# EasyEDA Pro project MicroMouse_v03_full_plane.eprj, board PCB2
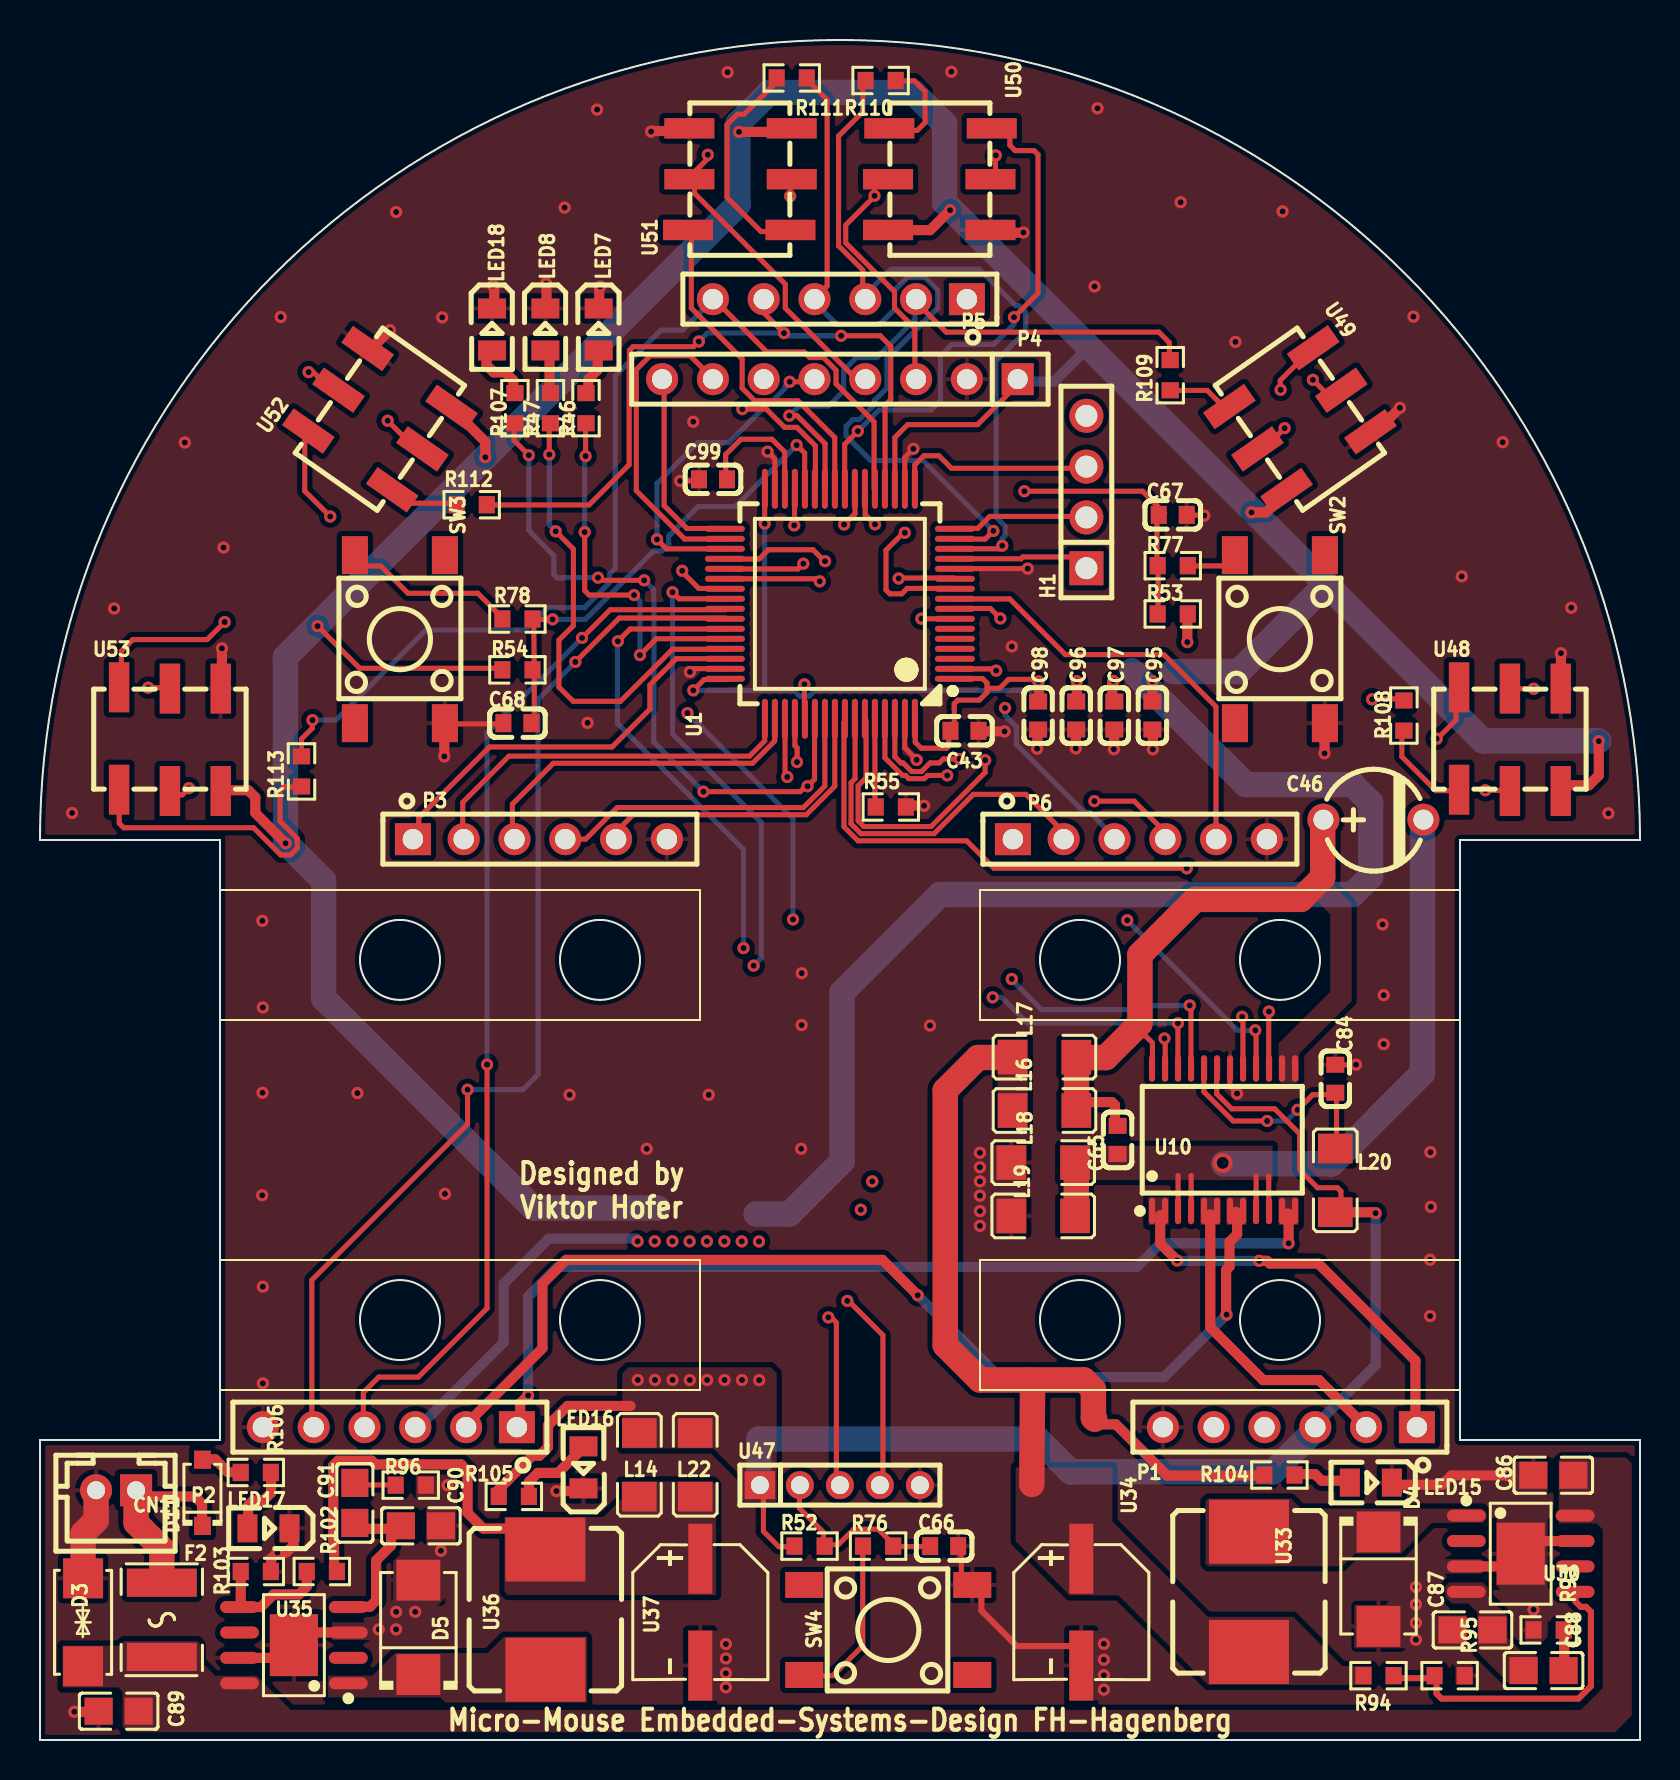
[diagram p4: board, top side]
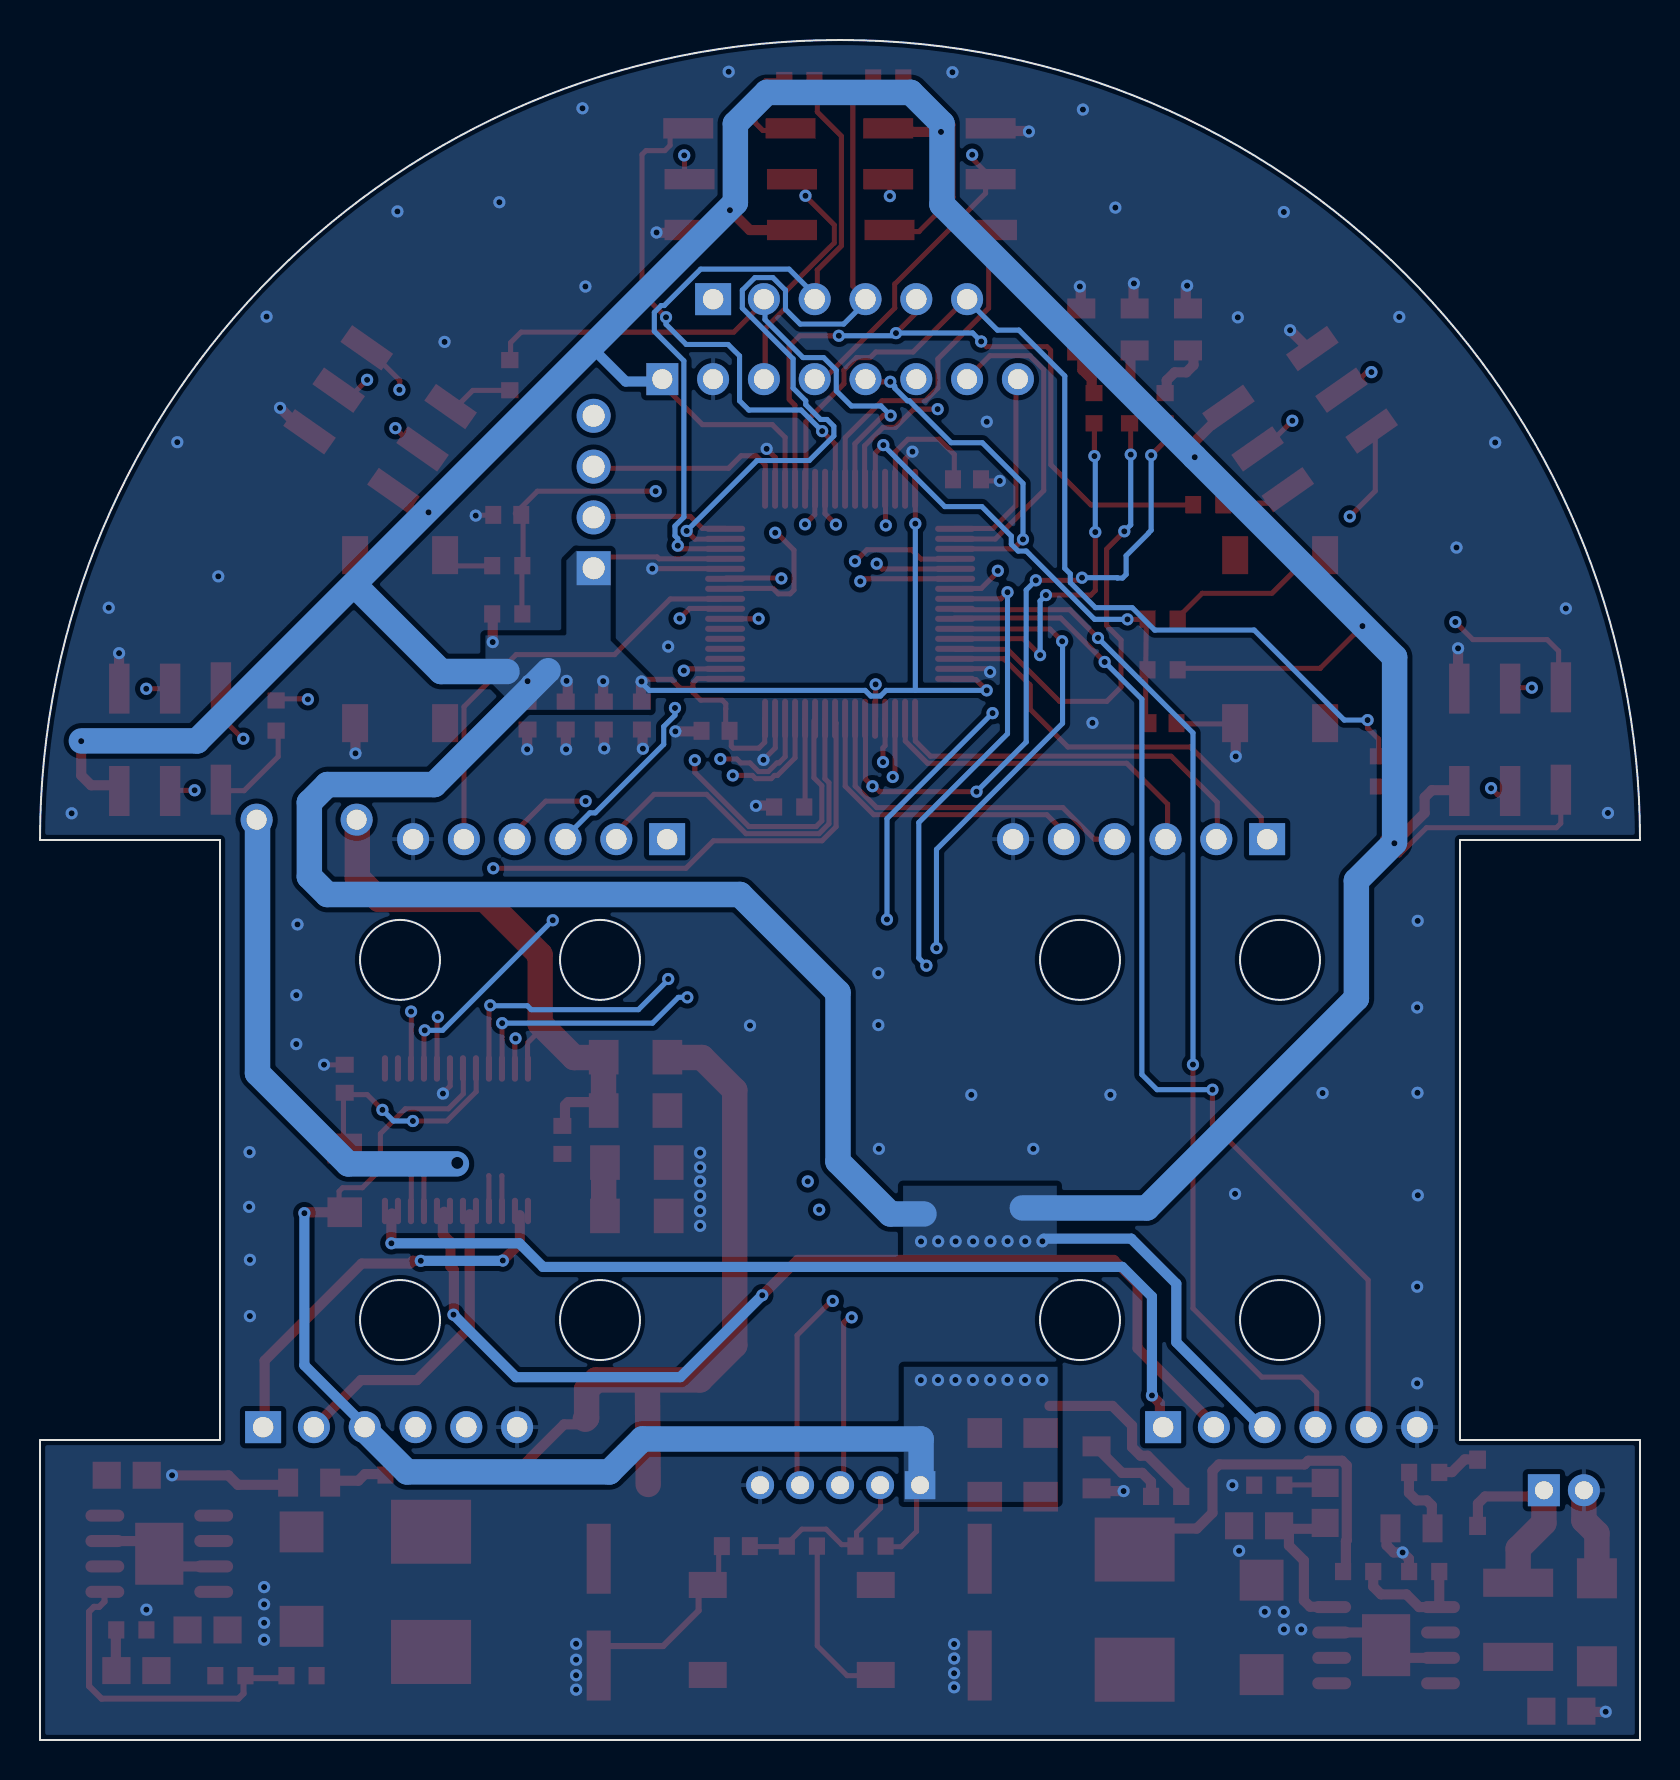
[diagram p5: board, bottom side, seen from below]

Outline 80 x 85 mm; copper layers: Top Layer, Inner1, Inner2, Inner3, Inner4, Bottom Layer. Coordinates in mm from the lower left corner of the outline.
Outline path: circle c18,39.01 r2 ; circle c18,21 r2 ; circle c28,39.01 r2 ; circle c28,21 r2 ; circle c52,39.01 r2 ; circle c52,21 r2 ; circle c62,39.01 r2 ; circle c62,21 r2 ; 9,42.5 9,30 ; 9,36 9,21 ; 71,42.5 71,23.75 71,36 ; 0,45 arc(40,85) 80,45 71,45 71,15 80,15 80,0 0,0 0,15 9,15 9,45 0,45
Stack: Top Layer 0.035mm Outer layer thickness 1oz / Dielectric1 0.0994mm 3313 RC57% 4.2mil / Inner1 0.0152mm Inner layer thickness / Dielectric2 0.55mm 0.55mm H/H No copper / Inner2 0.0152mm Inner layer thickness / Dielectric3 0.1088mm 2116 RC54% 4.9mil / Inner3 0.0152mm Inner layer thickness / Dielectric4 0.55mm 0.55mm H/H No copper / Inner4 0.0152mm Inner layer thickness / Dielectric5 0.0994mm 3313 RC57% 4.2mil / Bottom Layer 0.035mm Outer layer thickness 1oz

## Design rules (mm)
template: JLCPCB Capability(Multiple Layers Board)
spacing copperThickness1oz (default): track to track 0.102, other pairs 0.152 to 0.3
spacing copperThickness2oz: track to track 0.203, other pairs 0.152 to 0.3
spacing copperThicknessInner0.5oz: track to track 0.089, other pairs 0.152 to 0.3
track width copperThickness1oz (default): min 0.102, default 0.254, max 2.54
track width copperThickness2oz: min 0.203, default 0.254, max 2.54
track width copperThickness0.5oz: min 0.089, default 0.254, max 2.54
differential pair differentialPair (default): width min 0.127, default 0.254, max 2.54; gap min 0.152, default 0.152
via viaSize (default): diameter min 0.3, default 0.61, max 10; hole min 0.2, default 0.305, max 6.3

## Placement (name value [footprint] x y rotation side)
C43  1uF  [C0603]  46.22 50.46 0 top
C46  10uF  [CAP-TH_BD5.0-P5.00-D1.0-FD]  66.67 46.02 0 top
C65  100nF  [C0603]  53.88 30 90 top
C66  100nF  [C0603]  45.21 9.69 180 top
C67  100nF  [C0603]  56.64 61.26 180 top
C68  100nF  [C0603]  23.87 50.84 0 top
C84  100nF  [C0603]  64.77 33.06 270 top
C86  10uF  [C0805]  75.67 13.24 0 top
C87  220pF  [C0805]  71.62 5.5 0 top
C88  22nF  [C0805]  75.18 3.47 180 top
C89  10uF  [C0805]  3.93 1.44 0 top
C90  220pF  [C0805]  19.05 10.71 180 top
C91  22nF  [C0805]  15.74 11.85 270 top
C95  100nF  [C0603]  55.62 51.22 90 top
C96  100nF  [C0603]  51.81 51.22 90 top
C97  100nF  [C0603]  53.72 51.22 90 top
C98  100nF  [C0603]  49.91 51.22 90 top
C99  4.7uF  [C0603]  33.65 63.03 0 top
CN1  HX-PH2.0-2PZZ  [CONN-TH_2P-P2.50_HX-PH2.0-2PZZ]  3.81 12.49 180 top
D3  SMAJ20CA  [SMA_L4.3-W2.6-LS5.2-BI]  2.15 5.88 270 top
D4  STPS2L25U  [SMB_L4.6-W3.6-LS5.3-RD]  66.92 8.04 270 top
D5  STPS2L25U  [SMB_L4.6-W3.6-LS5.3-RD]  18.92 5.63 90 top
D11  BZT52C6V8  [SOD-123_L2.7-W1.7-LS3.8-RD]  8.12 12.36 90 top
F2  ASMD1812-300  [F1812]  6.09 6.01 90 top
H1  2.54-1*4P  [HDR-TH_4P-P2.54-V-F]  52.32 62.4 90 top
L14  LI1206H151R-10  [L1206]  29.97 13.76 90 top
L16  LI1206H151R-10  [L1206]  50.22 31.47 0 top
L17  LI1206H151R-10  [L1206]  50.22 34.14 0 top
L18  LI1206H151R-10  [L1206]  50.16 28.87 0 top
L19  LI1206H151R-10  [L1206]  50.16 26.2 0 top
L20  LI1206H151R-10  [L1206]  64.77 27.98 270 top
L22  LI1206H151R-10  [L1206]  32.76 13.76 90 top
LED7  XL-2012SURC  [LED0805-R-RD]  27.94 70.53 270 top
LED8  XL-2012SURC  [LED0805-R-RD]  25.27 70.53 270 top
LED15  XL-2012SURC  [LED0805-R-RD]  66.54 12.87 180 top
LED16  XL-2012SURC  [LED0805-R-RD]  27.17 13.63 90 top
LED17  XL-2012SURC  [LED0805-R-RD]  11.43 10.58 180 top
LED18  XL-2012SURC  [LED0805-R-RD]  22.6 70.53 270 top
P1  2.54-1*6P  [HDR-TH_6P-P2.54-V-F]  62.5 15.64 180 top
P2  2.54-1*6P  [HDR-TH_6P-P2.54-V-F]  17.5 15.64 180 top
P3  2.54-1*6P  [HDR-TH_6P-P2.54-V-F]  25 45.04 0 top
P4  2.54-1*8P母环保  [HDR-TH_8P-P2.54-V-F_2]  40 68.04 180 top
P5  2.54-1*6P  [HDR-TH_6P-P2.54-V-F]  40 72.04 180 top
P6  2.54-1*6P  [HDR-TH_6P-P2.54-V-F]  55 45.04 0 top
R46  10K  [R0603]  27.3 66.59 270 top
R47  10K  [R0603]  25.52 66.59 270 top
R52  10K  [R0603]  38.48 9.69 180 top
R53  10K  [R0603]  56.64 56.3 0 top
R54  10K  [R0603]  23.87 53.51 180 top
R55  10K  [R0603]  42.54 46.65 0 top
R76  1kΩ  [R0603]  41.91 9.69 180 top
R77  1kΩ  [R0603]  56.64 58.72 0 top
R78  1kΩ  [R0603]  23.87 56.05 180 top
R93  4.7kΩ  [R0603]  75.43 5.5 0 top
R94  24kΩ  [R0603]  66.92 3.22 180 top
R95  6.2kΩ  [R0603]  70.48 3.22 180 top
R96  4.7kΩ  [R0603]  18.54 12.74 180 top
R102  3kΩ  [R0603]  14.09 8.42 0 top
R103  1.8kΩ  [R0603]  10.79 8.42 180 top
R104  10K  [R0603]  61.97 13.25 180 top
R105  10K  [R0603]  23.69 12.18 180 top
R106  10K  [R0603]  10.79 13.38 180 top
R107  10K  [R0603]  23.74 66.59 270 top
R108  0Ω  [R0603]  68.19 51.22 90 top
R109  0Ω  [R0603]  56.51 68.24 90 top
R110  0Ω  [R0603]  42.03 82.97 180 top
R111  0Ω  [R0603]  37.59 83.1 0 top
R112  0Ω  [R0603]  21.59 61.76 0 top
R113  0Ω  [R0603]  13.08 48.43 90 top
SW2  TS-1002S-04326C  [KEY-SMD_4P-L6.0-W6.0-P4.50-LS9.0]  62 55.04 270 top
SW3  TS-1002S-04326C  [KEY-SMD_4P-L6.0-W6.0-P4.50-LS9.0]  18 55.04 270 top
SW4  TS-1002S-04326C  [KEY-SMD_4P-L6.0-W6.0-P4.50-LS9.0]  42.41 5.5 0 top
U1  STM32F446RET6  [LQFP-64_L10.0-W10.0-P0.50-LS12.0-BL]  40 56.81 90 top
U10  TB6612FNG,C,8,EL  [SSOP-24_L8.3-W5.6-P0.65-LS7.6-BL]  59.18 30.01 0 top
U30  L5973D  [SOIC-8_L4.9-W3.9-P1.27-LS6.0-BL-EP]  74.04 9.31 270 top
U33  1.5uH  [IND-SMD_L7.6-W6.9]  60.45 7.41 270 top
U34  330uF  [CAP-SMD_BD6.3-L6.6-W6.6-LS7.4-FD]  52.06 6.39 270 top
U35  L5973D  [SOIC-8_L4.9-W3.9-P1.27-LS6.0-BL-EP]  12.7 4.74 90 top
U36  1.5uH  [IND-SMD_L7.6-W6.9]  25.27 6.52 90 top
U37  330uF  [CAP-SMD_BD6.3-L6.6-W6.6-LS7.4-FD]  33.02 6.39 270 top
U47  DW200R-11-05-43  [HDR-TH_5P-P2.00-V-F]  40 12.74 0 top
U48  HC-PM254-5.0H-2x3PS-02A  [CONN-SMD_HC-PM254-5.0H-2X3PS-02A]  73.5 50.04 0 top
U49  HC-PM254-5.0H-2x3PS-02A  [CONN-SMD_HC-PM254-5.0H-2X3PS-02A]  63 66.04 305 top
U50  HC-PM254-5.0H-2x3PS-02A  [CONN-SMD_HC-PM254-5.0H-2X3PS-02A]  45 78.04 270 top
U51  HC-PM254-5.0H-2x3PS-02A  [CONN-SMD_HC-PM254-5.0H-2X3PS-02A]  35 78.04 90 top
U52  HC-PM254-5.0H-2x3PS-02A  [CONN-SMD_HC-PM254-5.0H-2X3PS-02A]  17 66.04 55 top
U53  HC-PM254-5.0H-2x3PS-02A  [CONN-SMD_HC-PM254-5.0H-2X3PS-02A]  6.5 50.04 0 top

## Footprints (pads in the part's own frame, mm; a bottom-side part is the same pattern mirrored in y, then rotated)
C0603
  rect 0.8x0.9 smd: 1(-0.7,0) 2(0.7,0)
C0805
  rect 1.41x1.35 smd: 1(-1,0) 2(1,0)
CAP-SMD_BD6.3-L6.6-W6.6-LS7.4-FD
  rect 3.5x1.2 smd: 1(-2.67,0) 2(2.67,0)
CAP-TH_BD5.0-P5.00-D1.0-FD
  round 1.6 hole 1: 1(-2.5,0) 2(2.5,0)
CONN-SMD_HC-PM254-5.0H-2X3PS-02A
  rect 1.02x2.5 smd: 1(-2.54,2.592) 2(-2.54,-2.527) 3(0,2.527) 4(0,-2.592) 5(2.54,2.527) 6(2.54,-2.592)
CONN-TH_2P-P2.50_HX-PH2.0-2PZZ
  rect 1.6x1.6 hole 0.9: 1(-1,0)
  round 1.6 hole 0.9: 2(1,0)
F1812
  rect 1.407x3.499 smd: 1(-1.853,0) 2(1.853,0)
HDR-TH_4P-P2.54-V-F
  rect 1.7x1.7 hole 1.1: 1(-3.81,0)
  round 1.7 hole 1.1: 2(-1.27,0) 3(1.27,0) 4(3.81,0)
HDR-TH_5P-P2.00-V-F
  rect 1.524x1.4 hole 0.9: 1(-4,0)
  round 1.4 hole 0.9: 2(-2,0) 3(0,0) 4(2,0) 5(4,0)
HDR-TH_6P-P2.54-V-F
  rect 1.8x1.6 hole 1.02: 1(-6.35,0)
  round 1.6 hole 1.02: 2(-3.81,0) 3(-1.27,0) 4(1.27,0) 5(3.81,0) 6(6.35,0)
HDR-TH_8P-P2.54-V-F_2
  rect 1.6x1.6 hole 1: 1(-8.89,0)
  round 1.6 hole 1: 2(-6.35,0) 3(-3.81,0) 4(-1.27,0) 5(1.27,0) 6(3.81,0) 7(6.35,0) 8(8.89,0)
IND-SMD_L7.6-W6.9
  rect 3.2x4 smd: 1(-3.005,0) 2(3.005,0)
KEY-SMD_4P-L6.0-W6.0-P4.50-LS9.0
  rect 1.9x1.3 smd: 1(-4.2,2.25) 2(4.2,2.25) 3(-4.2,-2.25) 4(4.2,-2.25)
L1206
  rect 1.485x1.728 smd: 1(-1.593,0) 2(1.593,0)
LED0805-R-RD
  rect 1x1.399 smd: 1(1.05,0) 2(-1.05,0)
LQFP-64_L10.0-W10.0-P0.50-LS12.0-BL
  oval 0.3x2 smd: 1(-3.75,-5.75) 2(-3.25,-5.75) 3(-2.75,-5.75) 4(-2.25,-5.75) 5(-1.75,-5.75) 6(-1.25,-5.75) 7(-0.75,-5.75) 8(-0.25,-5.75) 9(0.25,-5.75) 10(0.75,-5.75) 11(1.25,-5.75) 12(1.75,-5.75) 13(2.25,-5.75) 14(2.75,-5.75) 15(3.25,-5.75) 16(3.75,-5.75) 33(3.75,5.75) 34(3.25,5.75) 35(2.75,5.75) 36(2.25,5.75) 37(1.75,5.75) 38(1.25,5.75) 39(0.75,5.75) 40(0.25,5.75) 41(-0.25,5.75) 42(-0.75,5.75) 43(-1.25,5.75) 44(-1.75,5.75) 45(-2.25,5.75) 46(-2.75,5.75) 47(-3.25,5.75) 48(-3.75,5.75)
  oval 2x0.3 smd: 17(5.75,-3.75) 18(5.75,-3.25) 19(5.75,-2.75) 20(5.75,-2.25) 21(5.75,-1.75) 22(5.75,-1.25) 23(5.75,-0.75) 24(5.75,-0.25) 25(5.75,0.25) 26(5.75,0.75) 27(5.75,1.25) 28(5.75,1.75) 29(5.75,2.25) 30(5.75,2.75) 31(5.75,3.25) 32(5.75,3.75) 49(-5.75,3.75) 50(-5.75,3.25) 51(-5.75,2.75) 52(-5.75,2.25) 53(-5.75,1.75) 54(-5.75,1.25) 55(-5.75,0.75) 56(-5.75,0.25) 57(-5.75,-0.25) 58(-5.75,-0.75) 59(-5.75,-1.25) 60(-5.75,-1.75) 61(-5.75,-2.25) 62(-5.75,-2.75) 63(-5.75,-3.25) 64(-5.75,-3.75)
R0603
  rect 0.806x0.864 smd: 1(-0.753,0) 2(0.753,0)
SMA_L4.3-W2.6-LS5.2-BI
  rect 2x2 smd: 1(-2.2,0) 2(2.2,0)
SMB_L4.6-W3.6-LS5.3-RD
  rect 2.047x2.192 smd: 1(-2.361,0) 2(2.361,0)
SOD-123_L2.7-W1.7-LS3.8-RD
  rect 0.91x0.84 smd: 1(-1.655,0) 2(1.655,0)
SOIC-8_L4.9-W3.9-P1.27-LS6.0-BL-EP
  oval 0.602x1.941 smd: 1(-1.905,-2.72) 2(-0.635,-2.72) 3(0.635,-2.72) 4(1.905,-2.72) 5(1.905,2.72) 6(0.635,2.72) 7(-0.635,2.72) 8(-1.905,2.72)
  rect 3.098x2.41 smd: 9(0,0)
SSOP-24_L8.3-W5.6-P0.65-LS7.6-BL
  oval 0.308x1.324 smd: 1(-3.575,-3.562) 2(-2.925,-3.562) 3(-2.275,-3.562) 4(-1.625,-3.562) 5(-0.975,-3.562) 6(-0.325,-3.562) 7(0.325,-3.562) 8(0.975,-3.562) 9(1.625,-3.562) 10(2.275,-3.562) 11(2.925,-3.562) 12(3.575,-3.562) 13(3.575,3.562) 14(2.925,3.562) 15(2.275,3.562) 16(1.625,3.562) 17(0.975,3.562) 18(0.325,3.562) 19(-0.325,3.562) 20(-0.975,3.562) 21(-1.625,3.562) 22(-2.275,3.562) 23(-2.925,3.562) 24(-3.575,3.562)

## Nets
As in the schematic.

Pads without a net: P4 6; SW2 1 4; SW3 1 4; SW4 1 4; U1 3 4 5 6; U30 2 6; U35 2 6

## Via types
v1: diameter 0.61, hole 0.305, Top Layer to Bottom Layer, 227 vias
v2: diameter 1, hole 0.6, Top Layer to Bottom Layer, 1 via

## Routing (per net, layer and track width the routed paths; a pad name or vN(x,y) marks a point on that pad's centre or on a via; arc(x,y) is an arc through that point)
6V: length 40.7
  Top Layer w0.508: 52.96,15.78 53.8,15.78 56.36,13.22 61.03,13.22
  Top Layer w1.27: 49.55,17.99 49.63,17.91 49.59,12.78 ; 52.74,16.04 52.67,16.1 52.67,17.53 52.19,18 47,18 45.26,19.74 45.26,32.49 46.9,34.12 48.27,34.12 48.29,34.14
+3V3: length 387.4
  Top Layer w0.254: 43.76,51.1 43.76,49.88 44.06,49.59 45.34,49.59 45.44,49.69 45.44,50.42 ; 23.13,53.59 15.99,53.59 v1(13.88,55.7) ; 45.72,50.76 45.72,51.55 45.71,51.56 45.71,51.81 45.89,51.99 46.96,51.99 47.35,52.38 47.35,52.85 47.13,53.07 45.65,53.07 45.64,53.06 ; 52.1,58.86 51.8,59.15 49.14,59.15 49.05,59.06 45.74,59.06 ; 63.88,27.61 64.87,27.61 65.05,27.43 65.05,26.86 65.14,26.76 ; 36.23,62.56 v1(36.23,60.82) ; v1(32.66,52.48) 33.21,53.02 34.36,53.02 ; 37.56,9.66 36.94,9.66 36.17,10.43 36.17,12.63 ; 42.74,62.96 42.74,65.13 43.38,65.77 46.88,65.77 48.96,67.86 ; 49.8,53.03 48.43,53.03 47.98,52.59 47.37,52.59 47.36,52.59 ; 58.84,33.7 58.84,32.31 59.58,31.56 61.74,31.56 62.98,30.31 62.98,28.51 63.88,27.61
  Top Layer w0.508: 51.78,52.05 51.84,52.11 v1(51.84,52.94) ; 62.36,62.43 61.31,61.38 v1(60.57,61.38) ; 66.63,26.39 64.8,26.39 64.75,26.43 ; 37.56,80.62 37.35,80.4 v1(34.95,80.4) ; v1(77.94,49.94) 77.94,48.23 77.44,47.74 76.17,47.74 ; 22.83,12.43 24.62,14.21 24.97,14.21 25.4,14.64 25.4,15.72 26.38,16.7 29.53,16.7 ; v1(12.28,44.84) 10.77,46.35 10.77,47.13 10.41,47.49 9.1,47.49 9.02,47.57 ; 55.61,51.96 55.62,51.97 v1(55.62,52.94) ; v1(22.26,64.14) 22.26,64.92 20.59,66.59 ; v1(45.5,76.49) 44.51,75.5 42.6,75.5 ; 57.37,56.23 v1(57.37,54.9) ; 53.61,51.9 53.61,52.9 v1(53.67,52.96) ; 49.95,52 49.95,52.9
  Bottom Layer w0.254: v1(36.23,60.82) 36.23,52.5 36.25,52.49 ; v1(32.66,52.48) 37.69,52.48 37.98,52.2 38.46,52.2 38.74,52.48 49.54,52.48 49.97,52.91
  Bottom Layer w0.508: 18.94,15.64 23.19,19.89 23.19,22.82 25.44,25.07 29.81,25.07 29.86,25.02 ; 52.34,69.55 50.71,67.92 49.02,67.92 ; v1(66.78,26.34) 66.78,18.74 63.69,15.65
  Bottom Layer w1.27: 12.27,44.88 12.27,54.14 22.28,64.16 34.9,76.78 34.9,80.82 36.46,82.38 43.66,82.38 45.23,80.81 45.23,76.87 72.15,49.95 77.93,49.95 ; 30.88,26.6 24.66,26.6 14.18,37.08 14.18,42.97 12.31,44.83 ; 64.23,57.71 59.95,53.42 56.65,53.42 ; 54.59,53.47 60.29,47.77 65.63,47.77 66.53,46.87 66.53,43.17 65.63,42.27 45,42.27 40.1,37.38 40.1,28.92 37.48,26.3 35.8,26.3 ; 63.69,15.68 63.69,15.65 ; 63.69,15.45 61.65,13.4 51.53,13.4 49.88,15.05 35.94,15.05 35.94,13.11
  vias: v1(29.88,24.94) v1(29.89,18) v1(30.74,24.94) v1(30.75,18) v1(31.62,24.94) v1(31.63,18.01) v1(32.48,24.93) v1(32.49,18) v1(33.34,24.93) v1(33.36,18) v1(34.22,24.93) v1(34.23,18) v1(35.09,24.93) v1(35.1,18) v1(35.95,24.93) v1(35.96,17.99) v1(49.92,52.93)
+6V_MOT: length 27.4
  Top Layer w0.254: 55.62,33.72 55.62,34.86 55.08,35.4
  Top Layer w0.508: 52.35,31.84 52.41,31.89 53.59,31.89 53.75,31.74 53.75,30.7
  Top Layer w1.27: 64.13,45.99 64.13,43.12 63.05,42.03 57.76,42.03 55,39.26 55,35.82 53.3,34.12 52.05,34.12 ; 51.82,31.82 51.82,34.09
AGND: length 34.5
  Top Layer w0.254: 61.42,28.2 61.44,28.19 61.44,26.45 ; 57.56,28.22 57.56,28.21 57.56,26.45 ; 56.91,26.45 56.91,28.21 56.91,28.21 ; 60.81,26.45 60.81,28.2
  Top Layer w1.27: 51.74,29 51.82,28.93 51.82,26.08
  Bottom Layer w1.27: 69.12,46.03 69.12,33.34 64.59,28.81 59.18,28.81
  vias: v2(59.14,28.85)
GND: length 76.2
  Top Layer w0.254: v1(32.01,62.95) 32.97,62.95 32.97,62.96 ; 64.74,33.76 65.79,33.76 v1(65.8,33.77) ; 43.24,62.58 43.24,64.13 v1(43.67,64.56) ; 59.49,33.67 59.49,33.58 ; 46.3,7.88 46.07,8.11 46.07,9.77 ; 36.74,62.57 36.74,64.05 v1(36.38,64.42) ; v1(58.21,61.22) 58.19,61.24 57.32,61.24 ; 20.65,50.81 23.03,50.81 23.16,50.67 ; 45.77,58.57 v1(49.38,58.57) ; 59.49,33.58 59.49,32.7 59.85,32.34 v1(59.85,32.32) ; 34.21,53.57 32.66,53.57 v1(32.5,53.4) ; 43.24,51.06 43.24,49.6 v1(43.83,49.01)
  Top Layer w0.305: 52.22,4.7 48.84,4.7 47.07,6.47 47.07,7.33
  Top Layer w0.508: 32.63,80.45 30.58,80.45 v1(30.55,80.42) ; 66.4,65.35 66.74,65.35 v1(68,66.61) ; 43.28,46.72 44.19,46.72 v1(44.2,46.71) ; 27.39,12.45 v1(25.82,12.45) ; 46.96,50.5 47.03,50.43 v1(48.23,50.43) ; LED17.2 12.67,10.38 12.67,9.74 12.31,9.38 v1(11.87,9.38) 11.55,9.06 11.55,8.43 R103.1 ; 16.47,69.71 16.72,69.71 v1(17.5,70.49) ; 73.38,13.23 70.58,13.23 70.11,12.76 67.45,12.76 ; v1(9.1,54.58) 9.1,52.98 8.83,52.72 ; 64.14,51.09 64.23,51 v1(64.23,49.33) ; v1(53.69,49.54) 53.71,49.55 53.71,50.56 ; 75,9.96 75.01,9.95 76.76,9.95 ; 55.64,50.36 v1(55.64,49.54) ; 2.52,1.41 1.72,1.41 v1(1.72,1.41) ; v1(49.86,49.57) 49.87,49.58 49.87,50.55 ; 27.96,71.62 27.96,72.63 v1(28.01,72.67) ; U35.3 13.33,5.38 U35.9 12.06,4.11 U35.7 ; v1(49.17,75.38) 49.16,75.36 48.09,75.36 ; v1(51.79,49.58) 51.79,50.36 51.72,50.43 ; 25.33,71.86 25.33,72.81 v1(25.3,72.83) ; 22.71,71.53 22.71,72.65 v1(22.65,72.72) ; 20.21,50.78 v1(20.21,49.18) ; 72.97,8.68 72.96,8.68 71.31,8.68 ; 76.05,52.52 v1(76.05,54.34)
  Top Layer w1.27: D3.1 2.15,10.33 2.81,10.98 CN1.2
  Bottom Layer w0.254: v1(32.5,53.4) 32.49,53.4
  vias: v1(1.6,46.35) v1(3.71,56.58) v1(7.24,64.88) v1(9.18,59.62) v1(11.12,40.96) v1(11.14,36.63) v1(11.13,32.36) v1(11.11,27.24) v1(11.14,22.67) v1(11.14,17.83) v1(12.04,71.15) v1(15.87,32.35) v1(16.94,5.53) v1(17.81,76.4) v1(17.81,6.41) v1(17.81,5.53) v1(18.76,6.41) v1(20.11,71.13) v1(20.05,9.46) v1(20.25,27.31) v1(20.38,12.74) v1(26.23,76.62) v1(26.48,32.26) v1(27.38,50.86) v1(27.85,81.52) v1(30.33,29.56) v1(32.66,65.91) v1(33.44,32.26) v1(34.3,4.8) v1(34.3,4.08) v1(34.3,3.34) v1(34.3,2.63) v1(34.38,83.39) v1(38.09,38.34) v1(38.08,35.75) v1(38.06,29.56) v1(44.5,35.72) v1(45.57,83.41) v1(47,29.36) v1(47,28.64) v1(47,27.93) v1(47,27.22) v1(47,26.44) v1(47,25.71) v1(48.59,54.67) v1(52.73,72.67) v1(52.88,81.59) v1(53.19,4.81) v1(53.19,4.01) v1(53.19,3.24) v1(53.19,2.52) v1(57.03,76.89) v1(59.77,69.9) v1(62.13,76.43) v1(67.13,40.78) v1(67.19,37.24) v1(67.19,34.8) v1(68.67,71.17) v1(68.8,7.65) v1(68.8,6.78) v1(68.8,5.86) v1(68.8,5.01) v1(69.52,29.39) v1(69.54,26.66) v1(69.5,24.01) v1(69.51,21.2) v1(71.09,58.18) v1(73.14,64.89) v1(73.4,13.24) v1(74.68,6.52) v1(76.56,56.61) v1(78.42,46.34)
BOOT_O: length 4.3
  Top Layer w0.254: 41.7,46.74 41.75,46.79 41.75,51.05
BTN_02: length 34.5
  Top Layer w0.254: v1(35.12,66.54) 36.32,66.54 37.23,65.63 37.84,65.63 38.77,64.71 38.77,62.57 ; 55.9,56.38 55.9,58.52 ; 55.9,61.11 55.85,61.06 55.85,58.76 ; 56.24,61.33 55.13,62.44 v1(49.22,62.44)
  Inner2 w0.254: 35.17,66.51 35.78,66.51 36.16,66.89 44.66,66.89 49.12,62.43
BTN_03: length 24.4
  Top Layer w0.254: 24.72,50.86 24.72,53.45 24.69,55.93 24.58,56.03 ; v1(37.83,64.75) 38.23,64.34 38.23,62.61 ; v1(25.63,56.03) 24.78,56.03
  Bottom Layer w0.254: v1(37.83,64.75) 34.76,61.67 32.91,61.67 31.44,60.2 31.44,59.79 31.09,59.45 30.68,59.45 27.27,56.03 v1(25.63,56.03)
ENC_OUT_A1: length 60.5
  Top Layer w0.254: 41.26,62.53 41.26,61.27 v1(41.75,60.78)
  Inner2 w0.254: 41.72,27.84 44.95,24.61 54.2,24.61 61.18,17.62 61.18,15.64
  Inner3 w0.254: 41.61,60.81 41.61,27.93 v1(41.61,27.93)
ENC_OUT_A2: length 52.8
  Top Layer w0.254: 34.28,56.51 28.51,56.51 v1(27.1,55.1) ; v1(22.35,33.77) 22.35,21.58 18.91,18.15 16.94,18.15 16.17,17.38 16.17,15.79
  Bottom Layer w0.254: v1(27.1,55.1) 22.35,50.36 v1(22.35,33.77)
ENC_OUT_B1: length 60.3
  Top Layer w0.254: v1(40.21,60.77) 40.75,61.32 40.75,62.54
  Inner2 w0.254: 41.04,26.5 43.59,23.95 53.45,23.95 58.66,18.74 58.66,15.69
  Inner3 w0.254: 40.26,60.62 40.26,27.29 v1(41.04,26.52)
ENC_OUT_B2: length 53.7
  Top Layer w0.254: v1(21.38,32.52) 21.38,30.78 13.59,23 13.59,15.68 ; 34.28,56.1 28.96,56.1 v1(26.77,53.9)
  Bottom Layer w0.254: v1(26.77,53.9) 24.91,52.04 24.91,33.27 24.15,32.52 v1(21.38,32.52)
GPIO0_IR_LL: length 45.9
  Top Layer w0.254: v1(9.23,55.9) 8.35,55.02 4.64,55.02 4.07,54.45 4.07,52.82 ; 45.7,58.1 42.95,58.1 v1(42.93,58.08)
  Inner2 w0.254: 42.9,58.08 41.43,59.55 34.07,59.55 33.77,59.25 12.54,59.25 9.25,55.96
GPIO0_IR_LM: length 40.5
  Top Layer w0.254: 45.66,57.58 43.36,57.58 43.08,57.31 42.5,57.31 42.3,57.5 42.3,59.49 43.15,60.34 ; 13.24,65.33 13.24,62.45 v1(14.51,61.18)
  Inner2 w0.254: 14.7,61.07 35.66,61.07 35.99,61.4 41.96,61.4 42.29,61.07 42.54,61.07 v1(43.24,60.36)
GPIO0_IR_LR: length 17.2
  Top Layer w0.254: 39.74,62.54 39.74,65.12 37.9,66.96 35.74,66.96 35.11,67.59 35.11,69.06 32.57,71.59 32.57,75.2 32.36,75.41
GPIO0_IR_RL: length 25.5
  Top Layer w0.254: 40.23,62.65 40.23,64.78 v1(40.89,65.44) ; v1(48.7,71.14) 49.9,72.34 49.9,79.27 49.7,79.47 48.76,79.47 48.49,79.73 48.49,80.19 48.54,80.24
  Bottom Layer w0.254: v1(40.89,65.44) 41.95,66.5 44.56,66.5 45.02,66.96 45.02,69.2 45.59,69.78 47.69,69.78 48.7,70.79 v1(48.7,71.14)
GPIO0_IR_RM: length 25.6
  Top Layer w0.254: v1(47.81,53.47) 47.72,53.56 45.74,53.56 ; 62.01,67.51 62.01,67.98 63.59,69.56
  Inner2 w0.254: 47.76,53.56 49.38,53.56 53.45,57.62 53.45,58.93 v1(62.03,67.51)
GPIO0_IR_RR: length 38.6
  Top Layer w0.254: v1(47.26,48.99) 47.26,48.38 44.56,45.67 41.19,45.67 40.91,45.96 40.91,47.72 41.3,48.11 41.3,50.97 ; 70.8,51.85 70.8,51 69.98,50.18
  Inner2 w0.254: v1(69.84,50.06) 68.67,48.9 64.62,48.9 64.47,48.75 63.99,48.75 63.83,48.9 47.26,48.9
GPIO1_IR_LL: length 15.3
  Top Layer w0.254: 4.01,46.87 3.96,46.82 3.96,45.83 4.18,45.61 10.68,45.61 12.04,44.25 12.52,44.25 12.86,44.59 12.86,45.08 12,45.94 12,47.48 12.18,47.66 12.93,47.66 13.12,47.46
GPIO1_IR_LM: length 3.1
  Top Layer w0.254: 18,62.19 18.35,61.84 20.92,61.84
GPIO1_IR_LR: length 10.7
  Top Layer w0.254: 36.83,82.91 35.21,81.29 34.87,81.29 34.35,80.76 34.35,77.13 36.06,75.42 37.33,75.42
GPIO1_IR_RL: length 4.6
  Top Layer w0.254: 43.02,80.48 43.86,80.48 44.26,80.88 44.26,82.42 43.72,82.96 42.94,82.96 42.88,83.02
GPIO1_IR_RM: length 2.8
  Top Layer w0.254: 56.6,67.48 58.36,67.48 59.11,66.73
GPIO1_IR_RR: length 4.4
  Top Layer w0.254: 68.09,50.1 68.09,49.17 69.79,47.47 70.83,47.47
I2C2_SCL: length 159.8
  Top Layer w0.254: 6.39,47.26 7.11,47.26 v1(7.45,47.59) ; 37.51,78.02 v1(37.51,77.2) ; v1(72.27,47.49) 72.28,47.48 73.47,47.48 ; 19.16,64.51 18.83,64.51 v1(17.38,65.96) ; 41.73,77.97 v1(41.73,77.21) ; 41.72,77.18 40.29,75.75 40.29,74.86 42.73,72.42 42.73,71.59 43.74,70.58 43.74,68.4 ; 60.85,64.63 61.26,64.63 v1(62.23,65.59) ; v1(37.71,60.73) 37.72,60.75 37.72,62.53
  Inner3 w0.508: 37.55,60.62 36.96,60.02 36.96,54.25 29.43,46.72 ; 72.28,47.47 72.28,55.58 50.65,77.2 28.6,77.2 7.43,56.03 7.43,47.08 7.79,46.72 29.43,46.72
I2C2_SDA: length 159.3
  Top Layer w0.254: 38.22,51.12 v1(38.22,52.78) ; v1(47.79,79.23) 47.77,79.22 47.77,78.09 ; 64.57,66.98 64.57,67.08 v1(63.65,68.01) ; v1(13.43,68.39) 13.66,68.39 14.7,67.36 ; 32.72,77.88 32.72,77.34 37.26,72.8 37.26,71.59 40.97,67.89 ; 6.61,52.56 6.55,52.62 v1(5.41,52.62) ; 73.51,52.56 74.67,52.56 74.69,52.54 ; v1(33.39,79.26) 33.39,79.07 32.48,78.16
  Inner2 w0.508: 63.65,67.99 74.68,56.97 74.68,52.55 ; 63.65,67.99 63.64,68 ; 63.65,67.99 63.68,67.99 ; 63.62,67.99 52.39,79.23 24.21,79.23 5.41,60.43 5.41,50.4 7.44,48.37 33.76,48.37 38.13,52.74
  vias: v1(74.69,52.56)
IMU_ADR: length 16.4
  Top Layer w0.254: v1(37.49,67.91) 38.63,67.91 38.72,68 ; 34.23,59.56 31.33,59.56 v1(30.85,60.03)
  Bottom Layer w0.254: v1(30.85,60.03) 30.85,62.83 32.89,64.86 34.44,64.86 36.54,66.96 36.63,66.96 37.26,67.59 37.26,67.69 v1(37.49,67.91)
IMU_BOOT: length 16.1
  Top Layer w0.254: 33.63,68.09 32.51,69.21 30.51,69.21 29.81,68.52 29.81,62.47 32.23,60.05 34.25,60.05
IMU_RESET: length 9.6
  Top Layer w0.254: 34.27,60.58 32.35,60.58 31.21,61.72 31.21,67.78
M_AIN1: length 49.8
  Top Layer w0.254: 34.25,55.55 29.5,55.55 v1(28.89,54.94) ; 57.55,33.78 57.55,36.58 57.5,36.62
  Inner2 w0.254: 35.19,39.61 47.03,39.61 v1(48.59,38.05)
  Bottom Layer w0.254: 57.4,36.72 57.39,36.71 55.63,36.71 55.44,36.52 50.08,36.52 48.66,37.93 ; v1(35.18,39.6) 35.18,44.53 28.87,50.83 28.87,54.82
  vias: v1(57.49,36.73)
M_AIN2: length 47.6
  Top Layer w0.254: v1(31.62,57.39) 31.95,57.06 34.28,57.06 ; 56.9,35.84 56.9,33.98
  Inner2 w0.254: 35.77,38.61 37.25,37.13 v1(47.63,37.13)
  Bottom Layer w0.254: v1(56.9,35.84) 49.37,35.84 48.08,37.13 v1(47.63,37.13) ; v1(35.68,38.72) 36.06,39.1 36.06,45.88 31.62,50.31 v1(31.62,57.39)
M_AO1: length 19.9
  Top Layer w0.508: v1(56.86,23.97) 56.01,24.82 56.01,26.24 ; v1(60.96,23.96) 61.36,23.96 61.49,23.82 63.91,23.82 68.77,18.97 68.77,15.65
  Bottom Layer w0.508: v1(56.86,23.97) 56.87,23.96 v1(60.96,23.96)
M_AO2: length 15.4
  Top Layer w0.508: 58.51,26.29 58.51,20.63 61.15,18 63.95,18 66.2,15.74
M_BIN1: length 34.3
  Top Layer w0.254: 40.23,51.06 40.23,50.89 40.2,50.85 40.2,45.66 40.9,44.96 46.33,44.96 47.71,43.59 v1(57.34,43.59) ; 60.12,36.11 60.15,36.09 60.15,33.58
  Inner2 w0.254: 57.29,43.34 57.29,38.97 v1(60.11,36.16)
M_BIN2: length 50.1
  Top Layer w0.254: v1(60.76,35.48) 60.8,35.45 60.8,33.81 ; 33.87,57.58 32.94,57.58 32.15,58.37
  Inner2 w0.254: 37.51,41.03 48.45,41.03 49.31,41.89 53.46,41.89 v1(54.36,40.99)
  Inner3 w0.254: 32.07,58.42 32.37,58.11 32.37,54.11 31.91,53.64 31.91,52.41 32.37,51.95 v1(32.37,51.34)
  Bottom Layer w0.254: v1(32.37,51.34) 37.65,46.06 v1(37.65,41.03) ; v1(60.76,35.48) 59.87,35.48 v1(54.36,40.99)
  vias: v1(32.11,58.46)
M_BO1: length 47.2
  Top Layer w0.508: 62.4,26.33 62.43,26.3 v1(62.43,24.84) ; 24.01,15.78 24.01,16.83 v1(24.4,17.23)
  Bottom Layer w0.508: v1(62.43,24.84) 56.03,24.84 54.85,23.65 25.89,23.65 24.4,22.17 24.4,17.26
M_BO2: length 52.6
  Top Layer w0.508: 59.79,26.41 59.86,26.35 59.86,25.29 59.48,24.91 59.48,23.67 59.31,23.5 59.31,21.29 v1(59.33,21.27) ; v1(43.89,22.24) 42.12,24 26.31,24 25.12,22.82 25.12,19.59 21.56,16.03 21.04,16.03
  Bottom Layer w0.508: v1(43.89,22.24) 47.98,18.14 56.2,18.14 v1(59.33,21.27)
M_PWMA: length 28.7
  Top Layer w0.254: v1(45.36,48.23) 44.38,48.23 44.22,48.07 43.44,48.07 43.28,48.23 43.13,48.23 42.25,49.11 42.25,51.04 ; 56.26,35.05 56.26,33.58 56.25,33.57
  Inner2 w0.254: v1(56.22,35.08) 56.22,43.56 55.19,44.59 55.19,45.34 52.99,47.54 46.07,47.54 45.37,48.24
M_PWMB: length 32.3
  Top Layer w0.254: 42.74,51.05 42.74,49.16 43.05,48.85 43.16,48.85 43.59,48.42 44.07,48.42 44.5,48.85 44.96,48.85 45.16,49.05 v1(45.98,49.05) ; 61.44,33.6 61.44,36.39
  Inner2 w0.254: 46.11,49.09 47.23,47.96 54.25,47.96 56.09,46.12 56.71,46.12 57.34,45.49 57.34,44.87 59.02,43.19 59.02,38.29 60.89,36.42 v1(61.45,36.42)
PA0: length 36.5
  Top Layer w0.254: 40.87,71.95 41.14,72.21 41.14,73.5 39.93,74.71 39.93,80.2 41.14,81.41 41.14,83.11 ; v1(48.11,59.72) 47.96,59.56 45.69,59.56
  Bottom Layer w0.254: v1(48.11,59.72) 48.11,60.07 48.25,60.21 48.25,60.7 47.81,61.14 47.81,68.96 49.28,70.43 49.28,71.38 48.94,71.72 48.79,71.72 46.97,73.54 42.55,73.54 41.42,72.41
PA1: length 40.4
  Top Layer w0.254: v1(47.67,60.45) 47.26,60.04 45.81,60.04 ; 38.9,72.23 39.36,72.69 39.36,82.01 38.43,82.93
  Bottom Layer w0.254: 38.81,71.98 38.81,71.8 39.82,70.8 41.99,70.8 42.73,71.53 42.73,72.49 43.36,73.12 44.25,73.12 44.88,72.49 44.88,71.59 42.34,69.06 42.34,67.59 41.71,66.96 41.71,66.77 40.97,66.03 40.65,66.03 40.31,65.69 40.31,65.2 41.54,63.97 44.15,63.97 v1(47.67,60.45)
PA4: length 36.3
  Top Layer w0.254: v1(37.2,70.34) 36.12,71.42 36.12,72.04 ; 22.59,61.75 27.45,61.75 29.46,63.76 29.46,68.67 29.47,68.68 29.47,69.49 29.65,69.67 32.68,69.67 v1(32.94,69.93) ; v1(40.06,70.21) 42.01,70.21 42.54,69.68 42.54,67.03 42.25,66.74 42.25,62.59
  Bottom Layer w0.254: v1(32.94,69.93) 33.37,70.35 37.23,70.35 ; v1(40.06,70.21) 37.33,70.21 ; 37.21,70.33 v1(37.2,70.34)
PA5: length 50.7
  Top Layer w0.254: v1(13.62,51) 13.62,50.6 13.07,50.05 13.07,49.11 ; 41.71,62.57 41.71,65.91 39.8,67.81 39.8,68.49 39.17,69.12 38.49,69.12 38.21,69.4 36.34,69.4 33.82,71.93
  Bottom Layer w0.254: v1(13.62,51) 14.79,51 19.29,55.5 24.27,55.5 25.39,56.62 27.23,56.62 28.48,57.87 28.48,58.31 28.76,58.58 28.76,68.2 31.05,70.49 32.13,70.49 33.53,71.89
PB0: length 28.4
  Top Layer w0.254: v1(37.47,66.22) 37.85,66.22 39.25,64.81 39.25,62.57 ; 43.95,71.76 45.31,70.39 55.94,70.39 56.47,69.87 56.47,69.12
  Bottom Layer w0.254: 43.75,71.87 43.75,71.02 41.85,69.12 40.82,69.12 40.19,68.49 40.19,67.46 39.43,66.7 37.95,66.7 v1(37.47,66.22)
PC0: length 43.5
  Top Layer w0.254: 66.58,51.99 66.65,52.06 68.08,52.06 ; v1(48.02,56.08) 47.52,56.58 45.91,56.58
  Inner2 w0.254: 46.42,71.81 46.42,71.02 46.97,70.47 49.21,70.47 50.28,69.39 50.28,58.39 48.04,56.15
  Inner3 w0.254: v1(66.61,52.03) 62.72,55.92 48.08,55.92
SPI3_CS0: length 27.6
  Top Layer w0.254: 34.25,59.05 35.95,59.05 36.42,59.51 38.65,59.51 39.22,58.95
  Inner2 w0.254: 48.3,51.73 44.75,55.28 40.96,55.28 40.78,55.46 40.78,57.41 v1(39.25,58.94)
  Bottom Layer w0.254: v1(48.25,51.6) 48.25,51.23 48.81,50.67 48.81,49.78 52.24,46.36 52.51,46.36 53.83,45.03
SPI3_CS1: length 18
  Top Layer w0.254: 40.75,51.05 40.75,48.07 40.55,47.86 40.55,45.81 41.05,45.32 44.7,45.32 46.67,47.28 49.29,47.28 51.02,45.56 51.02,45.09
SPI3_MISO: length 22.3
  Top Layer w0.254: 56.38,45.27 54.71,46.94 v1(52.72,46.94) ; 37.78,48.87 37.86,48.95 37.86,49.61 37.75,49.71 37.75,51.05
  Inner2 w0.254: 52.65,46.74 52.2,47.18 44.83,47.18 43.11,48.91 37.82,48.91
  vias: v1(37.85,48.9)
SPI3_MOSI: length 21.7
  Top Layer w0.254: 58.73,45.04 58.73,45.14 58.8,45.21 58.8,51.67 56.2,54.27 51.27,54.27 48.49,57.05 45.97,57.05
SPI3_SCK: length 15.5
  Top Layer w0.254: v1(37.36,48.15) 37.25,48.26 37.25,51.05
  Inner2 w0.254: 37.56,48.19 38.05,48.19 38.32,48.46 41.62,48.46 43.96,46.12 45.7,46.12 46.79,45.04 48.6,45.04
ST_LED1: length 18.6
  Top Layer w0.254: v1(30,54.24) 30.82,55.06 34.2,55.06 ; v1(27.24,60.4) 27.24,57.47 27.46,57.25 v1(29.7,57.25) ; 27.26,65.8 27.28,65.78 v1(27.28,64.2)
  Bottom Layer w0.254: v1(27.24,60.4) 27.24,64.15 v1(27.28,64.2) ; v1(30,54.24) 30,56.95 v1(29.7,57.25)
ST_LED2: length 23.7
  Top Layer w0.254: v1(25.79,60.43) 26.67,59.55 26.67,55.72 25.95,55 25.95,52.65 26.66,51.93 29.02,51.93 31.63,54.54 34.22,54.54 ; 25.52,65.82 25.46,65.77 v1(25.46,64.27)
  Bottom Layer w0.254: v1(25.79,60.43) 25.46,60.76 v1(25.46,64.27)
ST_LED3: length 33.4
  Top Layer w0.254: v1(33.17,47.42) 38.01,47.42 38.32,47.73 ; 38.73,50.88 38.73,48.04 v1(38.38,47.69) ; 23.7,65.83 23.7,64.98 v1(24.44,64.24) ; v1(30.21,57.98) 28.03,57.98 v1(27.9,58.12)
  Bottom Layer w0.254: v1(33.17,47.42) 30.69,49.9 30.69,57.5 v1(30.21,57.98) ; v1(24.44,64.24) 24.44,60.49 24.57,60.36 ; v1(27.9,58.12) 26.15,58.12 26.13,58.1 25.87,58.1 25.69,58.28 25.69,59.21 24.56,60.35
STLINK_JTDI: length 17.1
  Top Layer w0.254: 36.74,50.99 36.74,49.95 35.62,48.84 25.66,48.84 23.62,46.79 23.62,45.15
STLINK_NJTRST: length 15.4
  Top Layer w0.254: 39.74,51.06 39.74,47.69 38.31,46.26 29.66,46.26 28.71,45.32
STLINK_NRST: length 71.7
  Top Layer w0.254: 37.97,12.7 37.97,11.59 39.17,10.39 39.17,9.66 ; 45.94,56.06 44.08,56.06 v1(44.07,56.07) ; 44.33,9.67 42.69,9.67 ; 39.22,9.73 39.26,9.77 39.92,9.77 40.69,10.54 41.9,10.54 42.65,9.8
  Inner3 w0.254: 37.96,13 37.96,18 42.56,22.59 42.56,54.67 44.04,56.16 ; 44.17,56.11 44.17,60.61 49.6,66.04 52.3,66.04
STLINK_RX: length 9.5
  Top Layer w0.254: 43.74,63.02 43.74,63.76 44.19,64.21 44.95,64.21 45.57,63.59 52.03,63.59
STLINK_SWO: length 17.4
  Top Layer w0.254: 26.29,45.04 27.28,45.04 28.86,46.62 38.16,46.62 39.24,47.7 39.24,51.06
STLINK_TCK: length 19.3
  Top Layer w0.254: 36.23,51.09 36.23,49.95 35.48,49.19 23.44,49.19 21.14,46.89 21.14,45.06
STLINK_TMS: length 19.6
  Top Layer w0.254: 33.64,54.06 31.81,54.06 30.49,52.75 30.49,51.54 28.6,49.65 22.47,49.65 18.94,46.11 18.94,45.19
STLINK_TX: length 6.8
  Top Layer w0.254: 45.73,60.56 45.75,60.58 46.89,60.58 47.49,61.18 52.28,61.18 52.29,61.17
UART_RX: length 50.6
  Top Layer w0.254: v1(38.99,57.93) 38.86,58.06 34.63,58.06 ; 40.41,21.97 42.15,20.24 42.15,12.92
  Inner3 w0.254: v1(40.37,21.95) 39.15,23.17 39.15,57.86
UART_TX: length 51.8
  Top Layer w0.254: v1(38.16,58.82) 37.9,58.55 34.51,58.55 ; 39.82,12.9 39.82,20.87 39.51,21.18
  Inner3 w0.254: v1(39.42,21.13) 36.62,23.92 36.62,52.86 38.14,54.37 38.14,58.94
$2N19187: length 9.8
  Top Layer w0.508: 4.87,12.52 5.21,12.18 7.75,12.18 8.1,11.82 8.1,10.79 8.18,10.72
  Top Layer w1.27: CN1.1 4.81,10.85 6.09,9.57 F2.2
$2N30811: length 1.9
  Top Layer w0.508: 76.21,5.49 76.21,3.77 76.31,3.67
$2N33033: length 16.1
  Top Layer w0.305: 69.82,3.16 69.82,2.32 70.08,2.07 76.92,2.07 77.55,2.69 77.55,6.41 77.3,6.66 77.04,6.66 76.78,6.92 76.78,7.44 ; 69.53,3.09 67.78,3.09 67.67,3.2
$2N33519: length 2
  Top Layer w0.254: 15.91,12.75 17.91,12.75 17.93,12.77
$2N33542: length 6.3
  Top Layer w0.508: 16.03,6.66 16.5,6.66 16.81,6.97 16.81,8.98 17.55,9.72 17.55,10.47 17.46,10.57 ; 17.46,10.56 16.01,10.56
$2N33543: length 16.9
  Top Layer w0.508: 23.76,10.59 23.74,10.57 22.16,10.57 21.38,11.36 21.38,13.45 21.05,13.78 16.77,13.78 16.59,13.96 14.9,13.96 14.66,13.73 14.66,9.98 14.7,9.94 14.7,8.7
$2N33549: length 6.3
  Top Layer w0.508: R103.2 10.04,6.71 U35.5 11.04,6.65 11.68,7.28 12.95,7.28 13.34,7.67 R102.1
$2N34682: length 4.2
  Top Layer w0.508: 24.45,12.28 24.45,12.92 24.89,13.35 25.9,13.35 27.26,14.71
$2N34710: length 2.4
  Top Layer w0.508: 65.36,12.96 64.08,12.96 63.75,13.29 63.07,13.29
$2N35274: length 3.6
  Top Layer w0.508: R106.1 11.55,13.37 11.55,12.36 11.17,11.98 10.66,11.98 10.41,11.73 10.41,10.62 LED17.1
$2N35278: length 2
  Top Layer w0.508: 8.22,14.03 8.76,14.03 9.4,13.4 10,13.4
$3N1929: length 2.9
  Top Layer w0.254: 59.9,59.41 59.2,58.7 57.31,58.7
$3N2172: length 8.1
  Top Layer w0.254: 23.02,56.21 21.89,57.34 18.4,57.34 17.04,58.7 15.94,58.7
$3N2375: length 8.2
  Top Layer w0.254: 38.33,3.22 39.64,3.22 41.14,4.71 41.14,9.44
$3N4904: length 2.2
  Top Layer w0.508: 27.25,67.42 27.42,67.59 27.42,68.04 27.89,68.51 27.89,69.39
$3N4908: length 2.1
  Top Layer w0.508: 25.47,69.5 25.48,69.5 25.48,67.41
$3N7852: length 11.5
  Top Layer w0.254: v1(61.36,30.95) 59.66,30.95 58.19,32.42 58.19,33.57 ; 64.78,32.27 64.83,32.22 64.83,29.84 ; 64.78,32.27 64.86,32.27 ; 64.78,32.27 64.71,32.34 ; v1(62.88,31.51) 63.64,32.27 64.71,32.27
  Bottom Layer w0.254: v1(61.36,30.95) 62.32,30.95 v1(62.88,31.51)
$3N28848: length 6.5
  Top Layer w0.254: 34.28,63.19 34.28,64.28 35.05,65.04 36.6,65.04 37.23,64.41 37.23,62.55
$3N34738: length 3
  Top Layer w0.508: 23.67,67.36 23.67,67.98 23.27,68.38 22.68,68.38 22.33,68.74 22.33,69.46 22.3,69.48

## Copper pours and planes (outline as drawn; the poured copper is in the pictures)
6V on Top Layer: 47.88,35.03 49.39,35.03 49.39,30.61 47.88,30.61
6V on Top Layer: 48.79,13.63 66.61,13.63 66.61,2.76 48.79,2.76
+3V3 on Top Layer: 29.11,18.64 36.83,18.64 36.83,11.9 29.11,11.9
+3V3 on Bottom Layer: 29.12,18.66 36.81,18.66 36.81,11.91 29.12,11.91
+3V3 on Bottom Layer: 49.47,59.47 57.73,59.47 57.73,51.5 49.47,51.5
+3V3 on Bottom Layer: 29.16,27.71 36.85,27.71 36.85,24.25 29.16,24.25
+3V3 on Inner2: 29.17,25.44 36.67,25.44 36.67,17.52 29.17,17.52
+6V_MOT on Top Layer: 61.93,42.93 65.58,42.93 65.58,32.86 61.93,32.86
AGND on Top Layer: 51.04,29.71 61.63,29.71 61.63,28 51.04,28
GND on Top Layer: -2.99,89.07 84.88,89.07 84.88,-1.74 -2.99,-1.74
GND on Top Layer: 65.71,9.04 72.15,9.04 72.15,2.76 65.71,2.76
GND on Top Layer: 51.45,5.47 53.8,5.47 53.8,1.97 51.45,1.97
GND on Top Layer: 32.41,5.48 34.96,5.48 34.96,1.95 32.41,1.95
GND on Top Layer: 72.83,13.92 75.39,13.92 75.39,4.9 72.83,4.9
GND on Top Layer: 14.6,13.22 20.82,13.22 20.82,5 14.6,5
GND on Top Layer: 46.61,29.74 49.33,29.74 49.33,25.32 46.61,25.32
GND on Bottom Layer: -2.99,89.45 82.6,89.45 82.6,-2.02 -2.99,-2.02
GND on Inner1: 0.26,84.75 79.74,84.75 79.74,0.26 0.26,0.26
GND on Inner2: -2.26,86.91 82.19,86.91 82.19,-2.09 -2.26,-2.09
GND on Inner3: -2.24,87.82 83.82,87.82 83.82,-2.42 -2.24,-2.42
GND on Inner4: 0.26,84.75 79.74,84.75 79.74,0.26 0.26,0.26
(no net) on Inner1: 26.26,22.74 29.74,22.74 29.74,19.25 26.26,19.25
(no net) on Inner1: 50.26,22.74 53.74,22.74 53.74,19.25 50.26,19.25
(no net) on Inner1: 60.26,40.75 63.74,40.75 63.74,37.26 60.26,37.26
(no net) on Inner1: 16.26,22.74 19.74,22.74 19.74,19.25 16.26,19.25
(no net) on Inner1: 60.26,22.74 63.74,22.74 63.74,19.25 60.26,19.25
(no net) on Inner1: 16.26,40.75 19.74,40.75 19.74,37.26 16.26,37.26
(no net) on Inner1: 26.26,40.75 29.74,40.75 29.74,37.26 26.26,37.26
(no net) on Inner1: 50.26,40.75 53.74,40.75 53.74,37.26 50.26,37.26
(no net) on Inner4: 50.26,40.75 53.74,40.75 53.74,37.26 50.26,37.26
(no net) on Inner4: 60.26,22.74 63.74,22.74 63.74,19.25 60.26,19.25
(no net) on Inner4: 26.26,22.74 29.74,22.74 29.74,19.25 26.26,19.25
(no net) on Inner4: 16.26,40.75 19.74,40.75 19.74,37.26 16.26,37.26
(no net) on Inner4: 60.26,40.75 63.74,40.75 63.74,37.26 60.26,37.26
(no net) on Inner4: 16.26,22.74 19.74,22.74 19.74,19.25 16.26,19.25
(no net) on Inner4: 26.26,40.75 29.74,40.75 29.74,37.26 26.26,37.26
(no net) on Inner4: 50.26,22.74 53.74,22.74 53.74,19.25 50.26,19.25
LIPO+ on Top Layer: 1.12,14.13 79.59,14.13 79.59,0.39 1.12,0.39
M_AO1 on Top Layer: 55.42,27.14 56.44,27.14 56.44,25.76 55.42,25.76
M_AO2 on Top Layer: 58.02,27.14 59.03,27.14 59.03,25.75 58.02,25.75
M_BO1 on Top Layer: 61.91,27.14 62.94,27.14 62.94,25.75 61.91,25.75
M_BO2 on Top Layer: 59.31,27.14 60.34,27.14 60.34,25.75 59.31,25.75
$2N30836 on Top Layer: 58.27,12.07 72.33,12.07 72.33,8.69 58.27,8.69
$2N30844 on Top Layer: 70.26,7.88 74.9,7.88 74.9,2.79 70.26,2.79
$2N33541 on Top Layer: 14.38,5.17 27.36,5.17 27.36,1.87 14.38,1.87
$2N33543 on Top Layer: 23.22,12.93 33.81,12.93 33.81,7.25 23.22,7.25

Small or netless copper shapes (teardrops, artwork), in the pictures only: 26 on Inner1, 26 on Inner4

## Text on the board
Top Silkscreen Layer: Designed by / Viktor Hofer | Micro-Mouse Embedded-Systems-Design FH-Hagenberg
